# Altium schematic sheet Main.SchDoc: BDOven
size Letter; Author: Isaias Rivera; DrawnBy: Isaias Rivera; Revision: 1; SheetNumber: 2; SheetTotal: 2
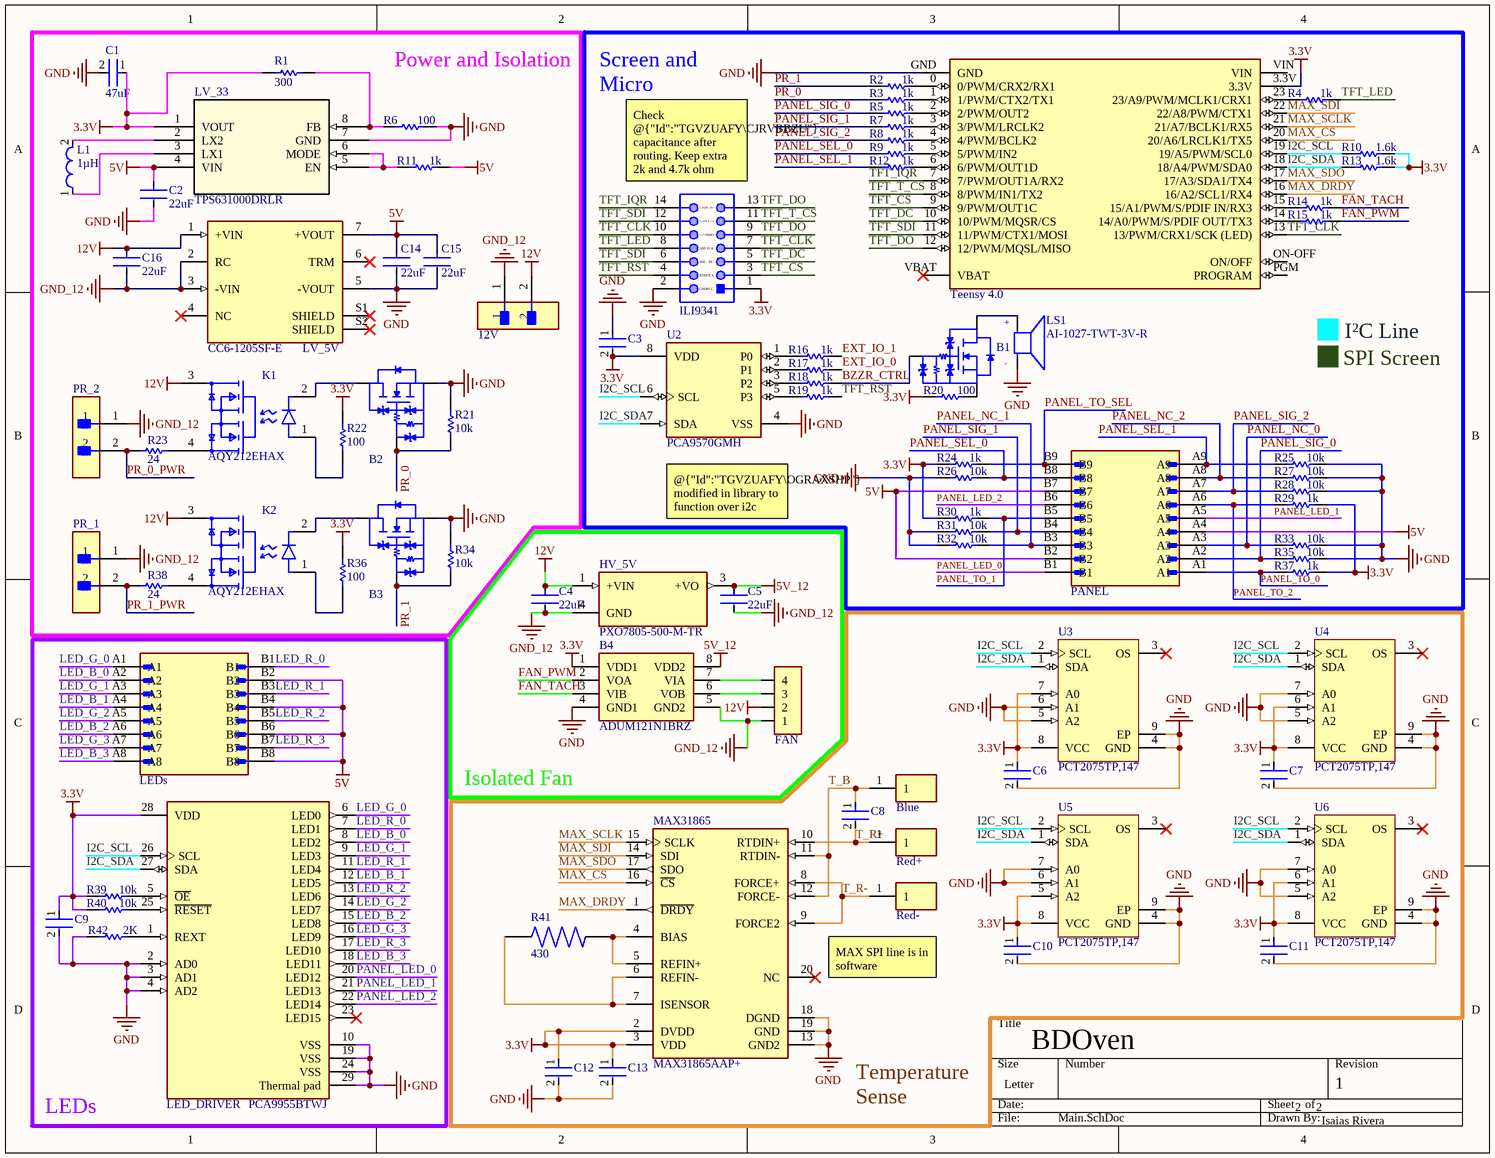
[diagram p0: Main.SchDoc]

## Parts
12V  105313-1302  [FP-105313-1102-MFG]  (value not drawn)
B1  SSM3K357R,LF  [SOTFL95P240X88-3N]  (value not drawn)
B2  SSM3K357R,LF  [SOTFL95P240X88-3N]  (value not drawn)
B3  SSM3K357R,LF  [SOTFL95P240X88-3N]  (value not drawn)
B4  ADUM121N1BRZ  [SOIC127P600X175-8N]
Blue  Blue Connector  [8191]  (value not drawn)
C1  47uF  [FP-CL31-IPC_C]
C2  22uF  [FP-CL31H-0_2-IPC_C]
C3  CL10B104JB8NNNC  [FP-CL10-0_1-MFG]  (value not drawn)
C4  22uF  [FP-CL31H-0_2-IPC_C]
C5  22uF  [FP-CL31H-0_2-IPC_C]
C6  CL10B104JB8NNNC  [FP-CL10-0_1-MFG]  (value not drawn)
C7  CL10B104JB8NNNC  [FP-CL10-0_1-MFG]  (value not drawn)
C8  CL10B104JB8NNNC  [FP-CL10-0_1-MFG]  (value not drawn)
C9  CL10B104JB8NNNC  [FP-CL10-0_1-MFG]  (value not drawn)
C10  CL10B104JB8NNNC  [FP-CL10-0_1-MFG]  (value not drawn)
C11  CL10B104JB8NNNC  [FP-CL10-0_1-MFG]  (value not drawn)
C12  CL10B104JB8NNNC  [FP-CL10-0_1-MFG]  (value not drawn)
C13  CL10B104JB8NNNC  [FP-CL10-0_1-MFG]  (value not drawn)
C14  22uF  [FP-CL31H-0_2-IPC_C]
C15  22uF  [FP-CL31H-0_2-IPC_C]
C16  22uF  [FP-CL31H-0_2-IPC_C]
FAN  47053-1000  [FP-47053-1000-MFG]  (value not drawn)
HV_5V  PXO7805-500-M-TR  [CONV_PXO7805-500-M-TR]
ILI9341  61201421721  [61201421721]  (value not drawn)
K1  AQY212EHAX  [FP-AQY212EHAX-MFG]
K2  AQY212EHAX  [FP-AQY212EHAX-MFG]
L1  value 1µH  [FP-DFE252012C-IPC_C]  (hidden comment: DFE252012P-1R0M=P2)
LED_DRIVER  PCA9955BTWJ  [FP-SOT1172-3-IPC_A]
LEDs  76383-308LF  [AMPHENOL_91687-306LF]  (value not drawn)
LS1  AI-1027-TWT-3V-R  [XDCR_AI-1027-TWT-3V-R]
LV_5V  CC6-1205SF-E  [CONV_CC6-1205SF-E]  (no BOM)
LV_33  TPS631000DRLR  [TPS631000DRLR_TEX]
MAX31865  MAX31865AAP+  [FP-A20-1-IPC_B]
PANEL  76383-309LF  [AMPHENOL_91687-306LF]  (value not drawn)
PR_1  105313-2302  [FP-105313-1102-MFG]  (value not drawn)
PR_2  105313-2302  [FP-105313-1102-MFG]  (value not drawn)
R1  value 300  [RESC1608X55X30LL15T15]  (hidden comment: ERJ-3EKF3000V)
R2  value 1k  [RESC1608X55X30LL15T15]  (hidden comment: ERJ-3EKF1001V)
R3  value 1k  [RESC1608X55X30LL15T15]  (hidden comment: ERJ-3EKF1001V)
R4  value 1k  [RESC1608X55X30LL15T15]  (hidden comment: ERJ-3EKF1001V)
R5  value 1k  [RESC1608X55X30LL15T15]  (hidden comment: ERJ-3EKF1001V)
R6  value 100  [RESC1608X55X30LL15T15]  (hidden comment: ERJ-3EKF1000V)
R7  value 1k  [RESC1608X55X30LL15T15]  (hidden comment: ERJ-3EKF1001V)
R8  value 1k  [RESC1608X55X30LL15T15]  (hidden comment: ERJ-3EKF1001V)
R9  value 1k  [RESC1608X55X30LL15T15]  (hidden comment: ERJ-3EKF1001V)
R10  value 1.6k  [RESC1608X55X30LL15T15]  (hidden comment: ERJ-3EKF1601V)
R11  value 1k  [RESC1608X55X30LL15T15]  (hidden comment: ERJ-3EKF1001V)
R12  value 1k  [RESC1608X55X30LL15T15]  (hidden comment: ERJ-3EKF1001V)
R13  value 1.6k  [RESC1608X55X30LL15T15]  (hidden comment: ERJ-3EKF1601V)
R14  value 1k  [RESC1608X55X30LL15T15]  (hidden comment: ERJ-3EKF1001V)
R15  value 1k  [RESC1608X55X30LL15T15]  (hidden comment: ERJ-3EKF1001V)
R16  value 1k  [RESC1608X55X30LL15T15]  (hidden comment: ERJ-3EKF1001V)
R17  value 1k  [RESC1608X55X30LL15T15]  (hidden comment: ERJ-3EKF1001V)
R18  value 1k  [RESC1608X55X30LL15T15]  (hidden comment: ERJ-3EKF1001V)
R19  value 1k  [RESC1608X55X30LL15T15]  (hidden comment: ERJ-3EKF1001V)
R20  value 100  [RESC1608X55X30LL15T15]  (hidden comment: ERJ-3EKF1000V)
R21  10k  [RESC1609X55X30ML15T15]
R22  value 100  [RESC1608X55X30LL15T15]  (hidden comment: ERJ-3EKF1000V)
R23  value 24  [RES_ERJP08J240V]  (hidden comment: ERJ-P08J240V)
R24  value 1k  [RESC1608X55X30LL15T15]  (hidden comment: ERJ-3EKF1001V)
R25  10k  [RESC1609X55X30ML15T15]
R26  10k  [RESC1609X55X30ML15T15]
R27  10k  [RESC1609X55X30ML15T15]
R28  10k  [RESC1609X55X30ML15T15]
R29  value 1k  [RESC1608X55X30LL15T15]  (hidden comment: ERJ-3EKF1001V)
R30  value 1k  [RESC1608X55X30LL15T15]  (hidden comment: ERJ-3EKF1001V)
R31  10k  [RESC1609X55X30ML15T15]
R32  10k  [RESC1609X55X30ML15T15]
R33  10k  [RESC1609X55X30ML15T15]
R34  10k  [RESC1609X55X30ML15T15]
R35  10k  [RESC1609X55X30ML15T15]
R36  value 100  [RESC1608X55X30LL15T15]  (hidden comment: ERJ-3EKF1000V)
R37  value 1k  [RESC1608X55X30LL15T15]  (hidden comment: ERJ-3EKF1001V)
R38  value 24  [RES_ERJP08J240V]  (hidden comment: ERJ-P08J240V)
R39  10k  [RESC1609X55X30ML15T15]
R40  10k  [RESC1609X55X30ML15T15]
R41  value 430  [RES_ERJ-PB3B4300V]  (hidden comment: ERJ-PB3B4300V)
R42  2K  [RESC2013X70X40ML20T20]
Red+  Red Connector  [8191]  (value not drawn)
Red-  Red Connector  [8191]  (value not drawn)
U1  Teensy 4.0  [MODULE_DEV-15583]
U2  PCA9570GMH  [FP-SOT902-2-MFG]
U3  PCT2075TP,147  [NXP-SOT1069-2_M]
U4  PCT2075TP,147  [NXP-SOT1069-2_M]
U5  PCT2075TP,147  [NXP-SOT1069-2_M]
U6  PCT2075TP,147  [NXP-SOT1069-2_M]

## Nets
3.3V: B4.1(VDD1) C1.1 C3.2 C6.1 C7.1 C9.1 C10.1 C11.1 C12.1 C13.1 ILI9341.1(VCC) LED_DRIVER.28(VDD) LV_33.1(VOUT) MAX31865.2(DVDD) MAX31865.3(VDD) R1.1 R10.2 R13.2 R20.1 R22.2 R24.2 R29.1 R30.2 R36.2 R37.1 R39.2 R40.2 U1.3.3V U2.8(VDD) U3.7(A0) U3.8(VCC) U4.6(A1) U4.8(VCC) U5.5(A2) U5.8(VCC) U6.6(A1) U6.8(VCC)
5V: C2.1 C14.1 C15.1 LEDs.B2 LEDs.B4 LEDs.B6 LEDs.B8 LV_5V.7(+VOUT) LV_33.4(VIN) PANEL.A4 PANEL.B2 PANEL.B7 R11.1
5V_12: B4.8(VDD2) C5.1 HV_5V.3(+VO)
12V: 12V.2 C4.1 C16.1 FAN.2 HV_5V.1(+VIN) K1.3(1_DRAIN) K2.3(1_DRAIN) LV_5V.1(+VIN)
GND: B2.2(S) B3.2(S) B4.4(GND1) C1.2 C2.2 C3.1 C6.2 C7.2 C9.2 C10.2 C11.2 C12.2 C13.2 C14.2 C15.2 ILI9341.2(GND) LED_DRIVER.2(AD0) LED_DRIVER.3(AD1) LED_DRIVER.4(AD2) LED_DRIVER.10(VSS) LED_DRIVER.19(VSS) LED_DRIVER.24(VSS) LED_DRIVER.29(Thermal_pad) LS1.N LV_5V.5(-VOUT) LV_33.7(GND) MAX31865.13(GND2) MAX31865.18(DGND) MAX31865.19(GND) R6.2 R21.1 R25.1 R26.2 R27.1 R28.1 R31.2 R32.2 R33.1 R34.1 R35.1 R42.1 U1.GND U2.4(VSS) U3.4(GND) U3.5(A2) U3.6(A1) U3.9(EP) U4.4(GND) U4.5(A2) U4.7(A0) U4.9(EP) U5.4(GND) U5.6(A1) U5.7(A0) U5.9(EP) U6.4(GND) U6.5(A2) U6.7(A0) U6.9(EP)
GND_12: 12V.1 B4.5(GND2) C4.2 C5.2 C16.2 FAN.1 HV_5V.4(GND) LV_5V.2(RC) LV_5V.3(-VIN) PR_1.1 PR_2.1
BZZR_CTRL: B1.1(G) R18.1
EXT_IO_0: R17.1
EXT_IO_1: R16.1
FAN_PWM: B4.2(VOA) R15.1
FAN_TACH: B4.3(VIB) R14.1
I2C_SCL: LED_DRIVER.26(SCL) R10.1 U1.19(19/A5/PWM/SCL0) U2.6(SCL) U3.2(SCL) U4.2(SCL) U5.2(SCL) U6.2(SCL)
I2C_SDA: LED_DRIVER.27(SDA) R13.1 U1.18(18/A4/PWM/SDA0) U2.7(SDA) U3.1(SDA) U4.1(SDA) U5.1(SDA) U6.1(SDA)
LED_B_0: LED_DRIVER.8(LED2) LEDs.A2
LED_B_1: LED_DRIVER.12(LED5) LEDs.A4
LED_B_2: LED_DRIVER.15(LED8) LEDs.A6
LED_B_3: LED_DRIVER.18(LED11) LEDs.A8
LED_G_0: LED_DRIVER.6(LED0) LEDs.A1
LED_G_1: LED_DRIVER.9(LED3) LEDs.A3
LED_G_2: LED_DRIVER.14(LED7) LEDs.A5
LED_G_3: LED_DRIVER.16(LED9) LEDs.A7
LED_R_0: LED_DRIVER.7(LED1) LEDs.B1
LED_R_1: LED_DRIVER.11(LED4) LEDs.B3
LED_R_2: LED_DRIVER.13(LED6) LEDs.B5
LED_R_3: LED_DRIVER.17(LED10) LEDs.B7
MAX_CS: MAX31865.16(~{CS}) U1.20(20/A6/LRCLK1/TX5)
MAX_DRDY: MAX31865.1(~{DRDY}) U1.16(16/A2/SCL1/RX4)
MAX_SCLK: MAX31865.15(SCLK) U1.21(21/A7/BCLK1/RX5)
MAX_SDI: MAX31865.14(SDI) U1.22(22/A8/PWM/CTX1)
MAX_SDO: MAX31865.17(SDO) U1.17(17/A3/SDA1/TX4)
PANEL_LED_0: LED_DRIVER.20(LED12) PANEL.B1
PANEL_LED_1: LED_DRIVER.21(LED13) PANEL.A5
PANEL_LED_2: LED_DRIVER.22(LED14) PANEL.B6
PANEL_NC_0: PANEL.A3 R33.2
PANEL_NC_1: PANEL.B3 R32.1
PANEL_NC_2: PANEL.A8 R27.2
PANEL_SEL_0: PANEL.B8 R9.2 R26.1
PANEL_SEL_1: PANEL.A9 R12.2 R25.2
PANEL_SIG_0: PANEL.A2 R5.2 R35.2
PANEL_SIG_1: PANEL.B4 R7.2 R31.1
PANEL_SIG_2: PANEL.A7 R8.2 R28.2
PANEL_TO_0: PANEL.A1 R37.2
PANEL_TO_1: PANEL.B5 R30.1
PANEL_TO_2: PANEL.A6 R29.2
PANEL_TO_SEL: PANEL.B9 R24.1
PR_0: B2.1(G) R3.2 R21.2
PR_0_PWR: PR_2.2 R23.1
PR_1: B3.1(G) R2.2 R34.2
PR_1_PWR: PR_1.2 R38.1
T_B: Blue.1 C8.1 MAX31865.11(RTDIN-) MAX31865.12(FORCE-)
T_R+: C8.2 MAX31865.10(RTDIN+) Red+.1
T_R-: MAX31865.8(FORCE+) MAX31865.9(FORCE2) Red-.1
TFT_CLK: ILI9341.7(SCK) ILI9341.10(T_CLK) U1.13(13/PWM/CRX1/SCK_(LED))
TFT_CS: ILI9341.3(CS) U1.9(9/PWM/OUT1C)
TFT_DC: ILI9341.5(DC) U1.10(10/PWM/MQSR/CS)
TFT_DO: ILI9341.9(SDO) ILI9341.13(T_DO) U1.12(12/PWM/MQSL/MISO)
TFT_IQR: ILI9341.14(T_IQR) U1.7(7/PWM/OUT1A/RX2)
TFT_LED: ILI9341.8(LED) R4.1
TFT_RST: ILI9341.4(RESET) R19.1
TFT_SDI: ILI9341.6(SDI) ILI9341.12(T_DIN) U1.11(11/PWM/CTX1/MOSI)
TFT_T_CS: ILI9341.11(T_CS) U1.8(8/PWM/IN1/TX2)
NetB1_2: B1.2(S) R20.2
NetB1_3: B1.3(D) LS1.P
NetB2_3: B2.3(D) K1.2(C)
NetB3_3: B3.3(D) K2.2(C)
NetB4_6: B4.6(VOB) FAN.3
NetB4_7: B4.7(VIA) FAN.4
NetK1_1: K1.1(A) R22.1
NetK1_4: K1.4(2_DRAIN) R23.2
NetK2_1: K2.1(A) R36.1
NetK2_4: K2.4(2_DRAIN) R38.2
NetL1_1: L1.1 LV_33.3(LX1)
NetL1_2: L1.2 LV_33.2(LX2)
NetLED_DRIVER_1: LED_DRIVER.1(REXT) R42.2
NetLED_DRIVER_5: LED_DRIVER.5(~{OE}) R39.1
NetLED_DRIVER_25: LED_DRIVER.25(~{RESET}) R40.1
NetLV_33_5: LV_33.5(EN) LV_33.6(MODE) R11.2
NetLV_33_8: LV_33.8(FB) R1.2 R6.1
NetMAX31865_4: MAX31865.4(BIAS) MAX31865.5(REFIN+) R41.1
NetMAX31865_6: MAX31865.6(REFIN-) MAX31865.7(ISENSOR) R41.2
NetR2_1: R2.1 U1.0(0/PWM/CRX2/RX1)
NetR3_1: R3.1 U1.1(1/PWM/CTX2/TX1)
NetR4_2: R4.2 U1.23(23/A9/PWM/MCLK1/CRX1)
NetR5_1: R5.1 U1.2(2/PWM/OUT2)
NetR7_1: R7.1 U1.3(3/PWM/LRCLK2)
NetR8_1: R8.1 U1.4(4/PWM/BCLK2)
NetR9_1: R9.1 U1.5(5/PWM/IN2)
NetR12_1: R12.1 U1.6(6/PWM/OUT1D)
NetR14_2: R14.2 U1.15(15/A1/PWM/S/PDIF_IN/RX3)
NetR15_2: R15.2 U1.14(14/A0/PWM/S/PDIF_OUT/TX3)
NetR16_2: R16.2 U2.1(P0)
NetR17_2: R17.2 U2.2(P1)
NetR18_2: R18.2 U2.3(P2)
NetR19_2: R19.2 U2.5(P3)

Not connected (* = marked no-connect by the designer): LED_DRIVER 23(LED15)*; LV_5V 4(NC)* 6(TRM)* S1(SHIELD)* S2(SHIELD)*; MAX31865 20(NC)*; U1 ON-OFF(ON/OFF) PGM(PROGRAM) VBAT* VIN; U3 3(OS)*; U4 3(OS)*; U5 3(OS)*; U6 3(OS)*

## Notes on the sheet
- (near R6) Power and Isolation
- Screen and Micro
- (near ILI9341) Check @{"Id":"TGVZUAFY\CJRVBBZU"} capacitance after routing. Keep extra 2k and 4.7k ohm resistors as backup
- SPI Screen
- I²C Line
- (near U2) @{"Id":"TGVZUAFY\OGRAXSHP"} modified in library to function over i2c
- Isolated Fan
- MAX SPI line is in software
- (near LED_DRIVER) LEDs
- Temperature
  Sense
- (in symbol CMP-561-000000-2) +; -

## Library data of the parts
12V = CMP-002-00113-2: Nano-Fit Right Angle Header Through Hole 2.50mm Pitch Single Row 2 Circuits 0.76; Connector Type: Header,Male Pin; Number of Positions: 2; Voltage Rating: 250V; Packaging: Tray; Contact Material: Brass; Contact Plating: Gold; Mounting Technology: Through Hole; Number of Rows: 1; Insulation Material: Polymer; Max Operating Temperature: 105°C; Min Operating Temperature: -40°C; Contact Shape: Square; Insulation Color: Black; RoHS Compliant: Yes; Termination: Solder; Fastening Type: Latch
B1-B3 = CMP-532-000000-3: Trans MOSFET N-CH Si 60V 0.65A Automotive 3-Pin SOT-23F T/R; Source: SSM3K357R,LF.SchLib; Design Item ID: SSM3K357R,LF
B4 = CMP-546-000000-2: Digital Isolator CMOS 2-CH 150Mbps 8-Pin SOIC N Tube; Manufacturer_Name: Analog Devices; Isolated Power: No; Pulse Width Distortion (PWD): 3ns; Min Supply Voltage: 4.5V; Number of Channels: 2; Propagation Delay: 13ns; Geometry.Height: 1.75mm; Max Supply Voltage: 5.5V; Channel Type: Unidirectional; Mouser Price/Stock: https://www.mouser.co.uk/ProductDetail/Analog-Devices/ADUM121N1BRZ?qs=lrf6x%2Foh5fBVNc%2Fo3CLfcQ%3D%3D; Data Rate: 150Mbps; Packaging: Rail/Tube; Manufacturer_Part_Number: ADUM121N1BRZ; Type: General Purpose; Mouser Part Number: 584-ADUM121N1BRZ; Reach SVHC Compliant: Yes; Pins: 8; Lead Free: Contains Lead; Source: ADUM121N1BRZ.SchLib; Case/Package: SOIC; RoHS Compliant: Yes; Max Operating Temperature: 125°C; Design Item ID: ADUM121N1BRZ; Min Operating Temperature: -40°C; Series: iCoupler®; Datasheet Link: http://www.analog.com/media/en/technical-documentation/data-sheets/ADuM120N_121N.pdf
Blue Red+ Red- = CMP-500-000000-3: TERM SCREW 6-32 4 PIN PCB; Manufacturer_Name: Keystone Electronics; Geometry.Height: 6.56mm; Connector Type: PCB,Terminal Block; Gender: Male; Insulation: Non-Insulated; Number of Contacts: 4; Number of Ports: 1; Body Material: Brass; Max Current Rating: 15A; Wire/Cable Gauge: 22AWG; Body Plating: Tin; Series: -; Mouser Price/Stock: https://www.mouser.co.uk/ProductDetail/Keystone-Electronics/8191?qs=lQmX4aIt5iAMQ8PQTpZ%2Fwg%3D%3D; Diameter: 0.31inch; Width: 0.02inch; Contact Plating: Tin; Mouser Part Number: 534-8191; Datasheet Link: http://www.keyelco.com/product-pdf.cfm?p=1517; Reach SVHC Compliant: Yes; Number of Rows: 2; Design Item ID: 8191; Pins: 4; Package Quantity: 100; Mounting Technology: Through Hole; Terminal Material: Brass; Number of Terminals/Pins: 4; Source: 8191.SchLib; Termination: Screw; Orientation: Straight; Current Rating: 15A; RoHS Compliant: Yes; Depth: 7.87mm; Manufacturer_Part_Number: 8191; Color: Silver; Packaging: Bulk; Height: 0.44inch; Lead Free: Lead Free; Contact Material: Brass; Material: Brass,Tin; Length: 0.21inch
C1 = CMP-001-00091-1: Cap Ceramic 47uF 10V X5R 20% SMD 1206 85°C Embossed Plastic T/R
C2 C4 C5 C14-C16 = CMP-001-00087-1: Ceramic capacitor SMD 1206 - 22uF/25V X5R# K +-10% Samsung, RoHS
C3 C6-C13 = CMP-13271-000011-1: CAP CER 0.1UF 50V X7R 0603; Manufacturer: Samsung Electro-Mechanics America, Inc; Value: 100nF; Material: Ceramic; Temperature Coefficient: 15%; Tolerance: 5%; Ipc Land Pattern Name: CAPC16080X80; Device Class L1: Passive Components; Digikey Description: CAP CER 0.1UF 50V X7R 0603; Voltage Rating: 50V; Height: 0.9mm; ComponentLink2Description: Datasheet; Device Class L2: Capacitors; ComponentLink2URL: http://www.samsungsem.com/kr/support/product-search/mlcc/__icsFiles/afieldfile/2019/06/18/CL10B104JB8NNNC-19.pdf; Temperature Characteristic: X7R; Temperature Range High: +125°C; Lead Free: Yes; Temperature Range Low: -55°C; Category: Cap; Manufacturer Part Number: CL10B104JB8NNNC; Package: CL10-0.1; Temperature: -55°C to +125°C; Octopart: https://octopart.com/cl10b104jb8nnnc-samsung-9302151; Device Class L3: Ceramic Capacitors; RoHS: TRUE; Automotive: No; Capacitance: 100nF
FAN = CMP-002-00097-2: CONN HEADER VERT 4POS 2.54MM; Voltage Rating (DC): 250V; Current Rating: 4A; Gender: Male; Glow Wire Compliant: Non-compliant; Number of Contacts: 4; Contact Material: Brass,Copper; Termination: Through Hole; Packaging: Bulk; Package Quantity: 12000; Mounting Technology: Through Hole; Length: 10.2mm; Number of Rows: 1; Voltage Rating: 250V; Depth: 5.84mm; Max Operating Temperature: 75°C; Series: 47053; Pitch: 2.54mm; Housing Material: Nylon; Orientation: Vertical; Radiation Hardening: No; Contact Plating: Tin; Number of Circuits: 4; Number of Positions: 4; Housing Color: Beige; Min Operating Temperature: 0°C; Halogen Free: Low Halogen
HV_5V = CMP-564-000000-2: 5 Vdc, 0.5 A, 2.5 W, 6.5~36 Vdc Input Range; MF: {'manufacturer': u'CUI'}; Availability: Unavailable; MP: PXO7805-500-M-TR; Source: PXO7805-500-M-TR.SchLib; Package: None; Price: None; Design Item ID: PXO7805-500-M-TR; Value: *
ILI9341 = CMP-002-00088-1: Male Box Header WR-BHD, THT, Angled, pitch 2.54 mm, 14 pins; Row Spacing: 0.1inch; Number of Contacts: 14; Voltage Rating: 250V; Gender: Male; Insulation Color: Black; Connector Type: Header; Color: Black; Packaging: Tray; Series: WR-BHD; Contact Plating: Gold; Termination: Solder; Contact Material: Copper Alloy,Copper; Contact Shape: Square; Insulation Material: PBT; Number of Positions: 14; Fastening Type: Pull; Contact Type: Male Pin; Flammability Rating: UL94 V-0; RoHS Compliant: Yes; Contact Finish - Mating: GOLD; Mounting Technology: Through Hole; Max Operating Temperature: 125°C; Pitch: 0.1inch; Number of Rows: 2; Min Operating Temperature: -40°C
K1 K2 = CMP-00026-00008-1: Relay Ssr 50MA 1.5V Dc-in 550MA 60V Ac/dc-out 4-PIN DIP SMD T/r; Throw Configuration: SPST; On-State Resistance: 2.5R; Input Type: DC; Packaging: Tape and Reel; Package Quantity: 1000; Relay Type: Relay; Max Output Voltage: 60V; RoHS Compliant: Yes; Termination: Gull Wing; Lead Free: Lead Free; Load Current: 550mA; Max Output current: 550mA; Max Input Current: 50mA; Mounting Technology: Surface Mount; Case/Package: SMD/SMT; Pins: 4; Series: PhotoMOS™ AQY
L1 = CMP-006-00030-1: Inductor Power Shielded Wirewound 1uH 20% 1MHz Metal 3.2A 0.042Ohm DCR 1008 T/R; Current Rating: 4.3A; Core Material: Ferrite; DC Resistance (DCR): 42mR; Depth: 2mm; Test Frequency: 1MHz; Resistor Type: Wirewound,Metal Alloy; Shielding: Shielded; Series: DFE252012P; Packaging: Cut Tape; Min Operating Temperature: -40°C; Max DC Current: 3.2A; RoHS Compliant: Yes; Length: 0.098inch; Case/Package: 1008; Mounting Technology: Surface Mount; Max Operating Temperature: 125°C; Width: 0.079inch; Case Code (Imperial): 1008; Height - Seated (Max): 0.039inch; Case Code (Metric): 2520; Tolerance: 20%
LED_DRIVER = CMP-00024-00006-2: LED DRVR Boost 16-CH Individual RGB PWM 20V 0.03A 28-Pin HTSSOP T/R; Output Current per Channel: 65mA; Min Input Voltage: 3V; Number of Channels: 16; Min Output Voltage: 800mV; Max Output current: 30mA; Max Supply Voltage: 5.5V; Series: -; Min Operating Temperature: -40°C; Pins: 28; Contact Plating: Gold,Silver; Max Output Voltage: 20V; RoHS Compliant: Yes; Number of Outputs: 16; Max Operating Temperature: 85°C; Topology: Boost; Lead Free: Lead Free; Mounting Technology: Surface Mount; Packaging: Cut Tape; Case/Package: HTSSOP
LEDs = CMP-002-00093-1: Dubox®2.54mm, Board to Board Connector, Shrouded Header, Double Row, Right Angle.; Gender: Male; MF: {'manufacturer': u'Amphenol ICC (FCI)'}; Voltage Rating: 1kV; Row Spacing: 0.1inch; Insulation Resistance: 100GR; Connector Type: Male Pin; Number of Positions: 16; Contact Post Length: 3.35mm; Pitch: 2.54mm; Current Rating: 3A; Depth: 13.28mm; Availability: Unavailable; Package: None; Contact Plating: Gold,GXT; Value: *; Series: DUBOX™, MezzSelect™, Basics+; Package Quantity: 26; Fastening Type: Friction; Length: 20.14mm; Max Voltage Rating (AC): 1kV; MP: 91687-306LF; Width: 9.34mm; Packaging: Rail/Tube; Design Item ID: 91687-306LF; Price: None; Orientation: Right Angle; Number of Rows: 2; Max Operating Temperature: 125°C; Radiation Hardening: No; Number of Contacts: 16; Termination: Solder; Color: Blue; Housing Color: Blue; Mounting Technology: Through Hole; RoHS Compliant: Yes; Lead Free: Lead Free; Contact Material: Bronze,Nickel,Gold; Contact Type: Male Pin; Min Operating Temperature: -40°C; Housing Material: Polyester; Source: 91687-306LF.SchLib; Contact Mating Length: 0.197inch
LS1 = CMP-561-000000-2: Audio Indicator Indicator Electromagnetic 3Vdc 30mA Pin 2Vdc 2500Hz to 2900Hz Through Hole; Washable: Yes; Frequency: 2.7kHz; Max Supply Voltage (DC): 5V; Input Type: DC; Min Supply Voltage (DC): 2V; MF: {'manufacturer': u'PUI Audio, Inc.'}; Voltage Rating: 3V; Width: 9.5mm; Packaging: Tray; Series: AI; Package: None; Height: 5mm; Source: AI-1027-TWT-3V-R.SchLib; Price: None; Sensing Method: Magnetic; Self Resonant Frequency: 2.7kHz; Max Supply Current: 30mA; Length: 9.5mm; Package Quantity: 150; MP: AI-1027-TWT-3V-R; Design Item ID: AI-1027-TWT-3V-R; Termination: PC Pins; Min Operating Temperature: -20°C; Operating Supply Current: 30mA; Diameter: 9.5mm; Contact Plating: Tin; RoHS Compliant: Yes; Voltage Rating (DC): 3V; Value: *; Nominal Supply Voltage (DC): 3V; Current Rating: 30mA; Availability: Unavailable; Max Operating Temperature: 80°C; Mounting Technology: Through Hole
LV_5V = CMP-549-000000-2: Module DC-DC 12VIN 1-OUT 5V 1.2A 6W 7-Pin DIP Module; Isolation: Isolated; Min Input Voltage: 9V; Nominal Supply Voltage: 12V; Number of Outputs: 1; Max Supply Voltage: 18V; MF: {'manufacturer': u'TDK-Lambda'}; Isolation Voltage: 500V; Source: CC6-1205SF-E.SchLib; Series: CC-E; Package Quantity: 40; Reach SVHC Compliant: Yes; Max Output current: 1.2A; Price: None; Depth: 21.1mm; Availability: Unavailable; MP: CC6-1205SF-E; Pins: 7; Max Operating Temperature: 85°C; Lead Free: Lead Free; Package: None; Height: 8.5mm; Length: 22.86mm; Nominal Output Voltage: 5V; Min Operating Temperature: -40°C; Max Input Voltage (DC): 18V; Max Power Dissipation: 6W; Width: 22.86mm; Value: *; Packaging: Tray; Output Power: 6W; Case/Package: PDIP; Design Item ID: CC6-1205SF-E; Current - Output 1: 1.2A; Radiation Hardening: No; Min Input Voltage (DC): 9V; Weight: 5.8g; RoHS Compliant: Yes; Mounting Technology: Through Hole,PCB; Output Current: 1.2A; Max Output Power: 6W; Voltage - Output 1: 5V; Output Voltage: 5V
LV_33 = CMP-512-000000-3: 1.5-A output current, high power density buck-boost converter 8-SOT-5X3 -40 to 125; Mfr_Name: Texas Instruments; Copyright: Copyright (C) 2023 Ultra Librarian. All rights reserved.; RefDes: RefDes; Source: TPS631000DRLR.SchLib; Design Item ID: TPS631000DRLR; Manufacturer_Part_Number: TPS631000DRLR; Type: DEV
MAX31865 = CMP-010-00025-3: MAX31865 Series 3.3 V RTD-to-Digital Converter - SSOP-20; Output Type: SPI; Series: -; Packaging: Rail/Tube; Case/Package: SSOP; Mounting Technology: Surface Mount; Min Operating Temperature: -40°C; RoHS Compliant: Yes; Max Operating Temperature: 125°C
PANEL = CMP-002-00091-2: Dubox®2.54mm, Board to Board Connector, Shrouded Header, Double Row, Right Angle.; Current Rating: 3A; MF: {'manufacturer': u'Amphenol ICC (FCI)'}; Number of Positions: 18; Row Spacing: 0.1inch; Gender: Male; Connector Type: Male Pin; Contact Post Length: 3.35mm; Insulation Resistance: 100GR; Max Voltage Rating (AC): 1kV; Pitch: 2.54mm; Price: None; Orientation: Right Angle; Fastening Type: Friction; Number of Rows: 2; Contact Plating: Gold,GXT; Design Item ID: 91687-306LF; Max Operating Temperature: 125°C; Depth: 13.28mm; Package Quantity: 23; MP: 91687-306LF; Min Operating Temperature: -40°C; Availability: Unavailable; Length: 22.68mm; Width: 9.34mm; Housing Material: Polyester; Color: Blue; Source: 91687-306LF.SchLib; Termination: Solder; Number of Contacts: 18; Package: None; Contact Type: Male Pin; RoHS Compliant: Yes; Housing Color: Blue; Radiation Hardening: No; Packaging: Rail/Tube; Voltage Rating: 1kV; Contact Mating Length: 0.197inch; Lead Free: Lead Free; Contact Material: Bronze,Nickel,Gold; Mounting Technology: Through Hole; Value: *; Series: DUBOX™, MezzSelect™, Basics+
PR_1 PR_2 = CMP-002-00114-2: Nano-Fit Right Angle Header Through Hole 2.50mm Pitch Single Row 2 Circuits 0.76; Voltage Rating: 250V; Number of Positions: 2; Series: Nano-Fit 105313; Contact Finish - Mating: GOLD; RoHS Compliant: Yes; Connector Type: Header; Packaging: Tray; Number of Rows: 1; Mounting Technology: Through Hole; Min Operating Temperature: -40°C; Insulation Color: Natural; Contact Shape: Square; Contact Plating: Gold; Contact Material: Brass; Insulation Material: Polymer; Contact Type: Male Pin; Fastening Type: Latch; Termination: Solder; Max Operating Temperature: 105°C
R1 = CMP-009-00229-1: RES SMD 300 OHM 1% 1/10W 0603; Power Rating: 100mW; Voltage Rating (DC): 75V; Temperature Coefficient: 100ppm/°C; Mounting Technology: Surface Mount; Depth: 0.8mm; Package Quantity: 1; Termination: SMD/SMT; Construction: Rectangular; Packaging: Tape and Reel; Case Code (Metric): 1608; Series: ERJ; Case/Package: 0603; Contact Plating: Tin; Tolerance: 1%; Features: Automotive AEC-Q200; Max Operating Temperature: 155°C; Width: 0.8mm; Max Power Dissipation: 100mW; Radiation Hardening: No; Case Code (Imperial): 0603; RoHS Compliant: Yes; Height: 0.022inch; Reach SVHC Compliant: Yes; Military Standard: Not; Resistance Tolerance: 1%; Voltage Rating: 75V; Number of Terminations: 2; Lead Free: Lead Free; Length: 1.6mm; Resistor Type: Thick Film; Min Operating Temperature: -55°C
R2-R5 R7-R9 R11 R12 R14-R19 R24 R29 R30 R37 = CMP-009-00014-6: Chip Resistor, 1 KOhm, +/-1%, 0.1 W, -55 to 155 degC, 0603 (1608 Metric); Voltage Rating: 75V; Tolerance: 1%; Power: 100mW; RoHS Compliant: Yes; Case/Package: 0603; Min Operating Temperature: -55°C; Max Operating Temperature: 155°C; Mounting Technology: Surface Mount; Pins: 2
R6 R20 R22 R36 = CMP-009-00230-1: Res Thick Film 0603 100 Ohm 1% 1/10W ±100ppm/°C Molded SMD Punched Carrier T/R; Voltage Rating (DC): 75V; Power Rating: 100mW; Weight: 7.1E-05oz; Case/Package: 0603; Min Operating Temperature: -55°C; Packaging: Tape and Reel; Depth: 0.8mm; Mounting Technology: Surface Mount; Military Standard: Not; Contact Plating: Tin; Length: 1.6mm; Pins: 2; Series: ERJ; Max Operating Temperature: 155°C; Number of Terminations: 2; Radiation Hardening: No; Reach SVHC Compliant: Yes; Tolerance: 1%; Lead Free: Lead Free; RoHS Compliant: Yes; Case Code (Imperial): 0603; Width: 0.8mm; Package Quantity: 5000; Temperature Coefficient: 100ppm/°C; Resistance Tolerance: 1%; Resistor Type: Thick Film; Features: Automotive AEC-Q200; Voltage Rating: 75V; Height: 0.45mm; Max Power Dissipation: 100mW; Termination: SMD/SMT; Case Code (Metric): 1608; Construction: Rectangular
R10 R13 = CMP-009-00228-1: Res Thick Film 0603 1.6K Ohm 1% 1/10W +/-100ppm/ßC Molded SMD Punched Carrier T/R; Voltage Rating: 75V; Power Rating: 100mW; Temperature Coefficient: 100ppm/°C; Termination: SMD/SMT; Reach SVHC Compliant: Yes; Length: 1.6mm; Mounting Technology: Surface Mount; Depth: 0.8mm; Lead Free: Lead Free; Case Code (Metric): 1608; Contact Plating: Tin; Resistor Type: Thick Film; Features: Automotive AEC-Q200; Resistance Tolerance: 1%; Height: 0.022inch; Number of Terminations: 2; Construction: Rectangular; Packaging: Tape and Reel; Case Code (Imperial): 0603; Tolerance: 1%; Min Operating Temperature: -55°C; Series: ERJ; Voltage Rating (DC): 75V; Max Operating Temperature: 155°C; Width: 0.8mm; Case/Package: 0603; Max Power Dissipation: 100mW; Package Quantity: 1; RoHS Compliant: Yes; Military Standard: Not
R21 R25-R28 R31-R35 R39 R40 = CMP-009-00181-1: Res Thick Film 0603 10K Ohm 1% 1/10W ±100ppm/°C Molded SMD Punched Carrier T/R
R23 R38 = CMP-009-00231-2: Res Thick Film 1206 24 Ohm 5% 0.33W ±200ppm/°C Molded SMD Punched Carrier T/R; Voltage Rating: 500V; Voltage Rating (DC): 200V; MF: {'manufacturer': u'Panasonic'}; Power Rating: 660mW; Max Power Dissipation: 667mW; Packaging: Tape and Reel; Max Operating Temperature: 155°C; Series: ERJ; Case Code (Imperial): 1206; Min Operating Temperature: -55°C; Tolerance: 5%; Contact Plating: Tin; Design Item ID: ERJP08J240V; Price: None; Length: 0.126inch; Case/Package: 1206; Radiation Hardening: No; Features: Automotive AEC-Q200; Case Code (Metric): 3216; Number of Terminations: 2; Package Quantity: 1; Temperature Coefficient: 200ppm/°C; Mounting Technology: Surface Mount; Resistor Type: Thick Film; Height: 0.028inch; MP: ERJP08J240V; Width: 1.6mm; RoHS Compliant: Yes; Availability: Unavailable; Source: ERJ-P08J240V.SchLib
R41 = CMP-009-00219-2: Res SMD 430 Ohm 0.1% 1/5W 0603; Temperature Coefficient: 50ppm/°C; Max Power Dissipation: 200mW; MF: {'manufacturer': u'Panasonic'}; Ratings: AEC-Q200; Availability: Unavailable; Case Code (Imperial): 0603; Price: None; Resistor Type: Thick Film; Length: 0.063inch; Source: ERJ-PB3B4300V.SchLib; Min Operating Temperature: -55°C; MP: ERJ-PB3B4300V; Width: 0.032inch; Height - Seated (Max): 0.022inch; Packaging: Cut Tape; Series: ERJ; Design Item ID: ERJ-PB3B4300V; Features: Automotive AEC-Q200; Case Code (Metric): 1608; Max Operating Temperature: 155°C; Number of Terminations: 2; Tolerance: 0.1%; Case/Package: 0603
R42 = CMP-009-00198-1: RES SMD 2K OHM 1% 1/8W 0805
U1 = CMP-00004-4: RT1062 Teensy 4.0 i.MX ARMÂ® CortexÂ®-M7 MPU Embedded Evaluation Board; MF: {'manufacturer': u'SparkFun Electronics'}; MP: DEV-15583; Value: *; Package: None; Design Item ID: DEV-15583; Price: None; Source: DEV-15583.SchLib; Availability: Unavailable
U2 = CMP-015-00010-2: I2C/SMBus Interface 100kHz/400kHz 3.6V 8-Pin XQFN T/R; Number of I/Os: 4; Frequency: 100kHz; Output Current: 25mA; Interface: I2C,SMBus,Serial; Output Type: PUSH-PULL; Clock Frequency: 1MHz; Operating Supply Current: 6.5uA; Min Operating Temperature: -40°C; Lead Free: Lead Free; Mounting Technology: Surface Mount; Series: -; Packaging: Tape and Reel; Pins: 8; Operating Supply Voltage: 3.6V; Package Quantity: 1; Max Operating Temperature: 85°C; Contact Plating: Gold; RoHS Compliant: Yes
U3-U6 = CMP-010-00026-3: Temp Sensor Digital Serial (2-Wire, I2C, SMBus) Automotive 8-Pin HWSON EP T/R; Output Type: I2C,Digital; Nominal Supply Current: 125µA; Min Supply Voltage: 2.7V; Interface: I2C,Serial,2-Wire; Max Supply Voltage: 5.5V; Resolution: 11b; Supply Current: 125uA; Max Output current: 200uA; Pins: 8; Series: PCT2076; Radiation Hardening: No; Reach SVHC Compliant: Yes; RoHS Compliant: Yes; Max Operating Temperature: 125°C; Package Quantity: 1; Packaging: Tape and Reel; Min Operating Temperature: -55°C; Case/Package: SON; Lead Free: Lead Free